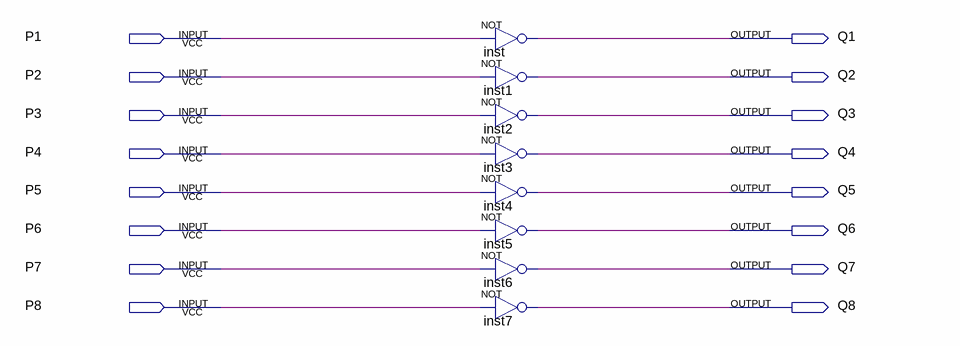
[diagram p0: schematic sheet]
// Quartus schematic not8.bdf as structural Verilog: 8 symbols, 16 pins
module not8 (
  input  P1,
  input  P2,
  input  P3,
  input  P4,
  input  P5,
  input  P6,
  input  P7,
  input  P8,
  output Q1,
  output Q2,
  output Q3,
  output Q4,
  output Q5,
  output Q6,
  output Q7,
  output Q8
);

  not inst (Q1, P1);
  not inst1 (Q2, P2);
  not inst2 (Q3, P3);
  not inst3 (Q4, P4);
  not inst4 (Q5, P5);
  not inst5 (Q6, P6);
  not inst6 (Q7, P7);
  not inst7 (Q8, P8);
endmodule
